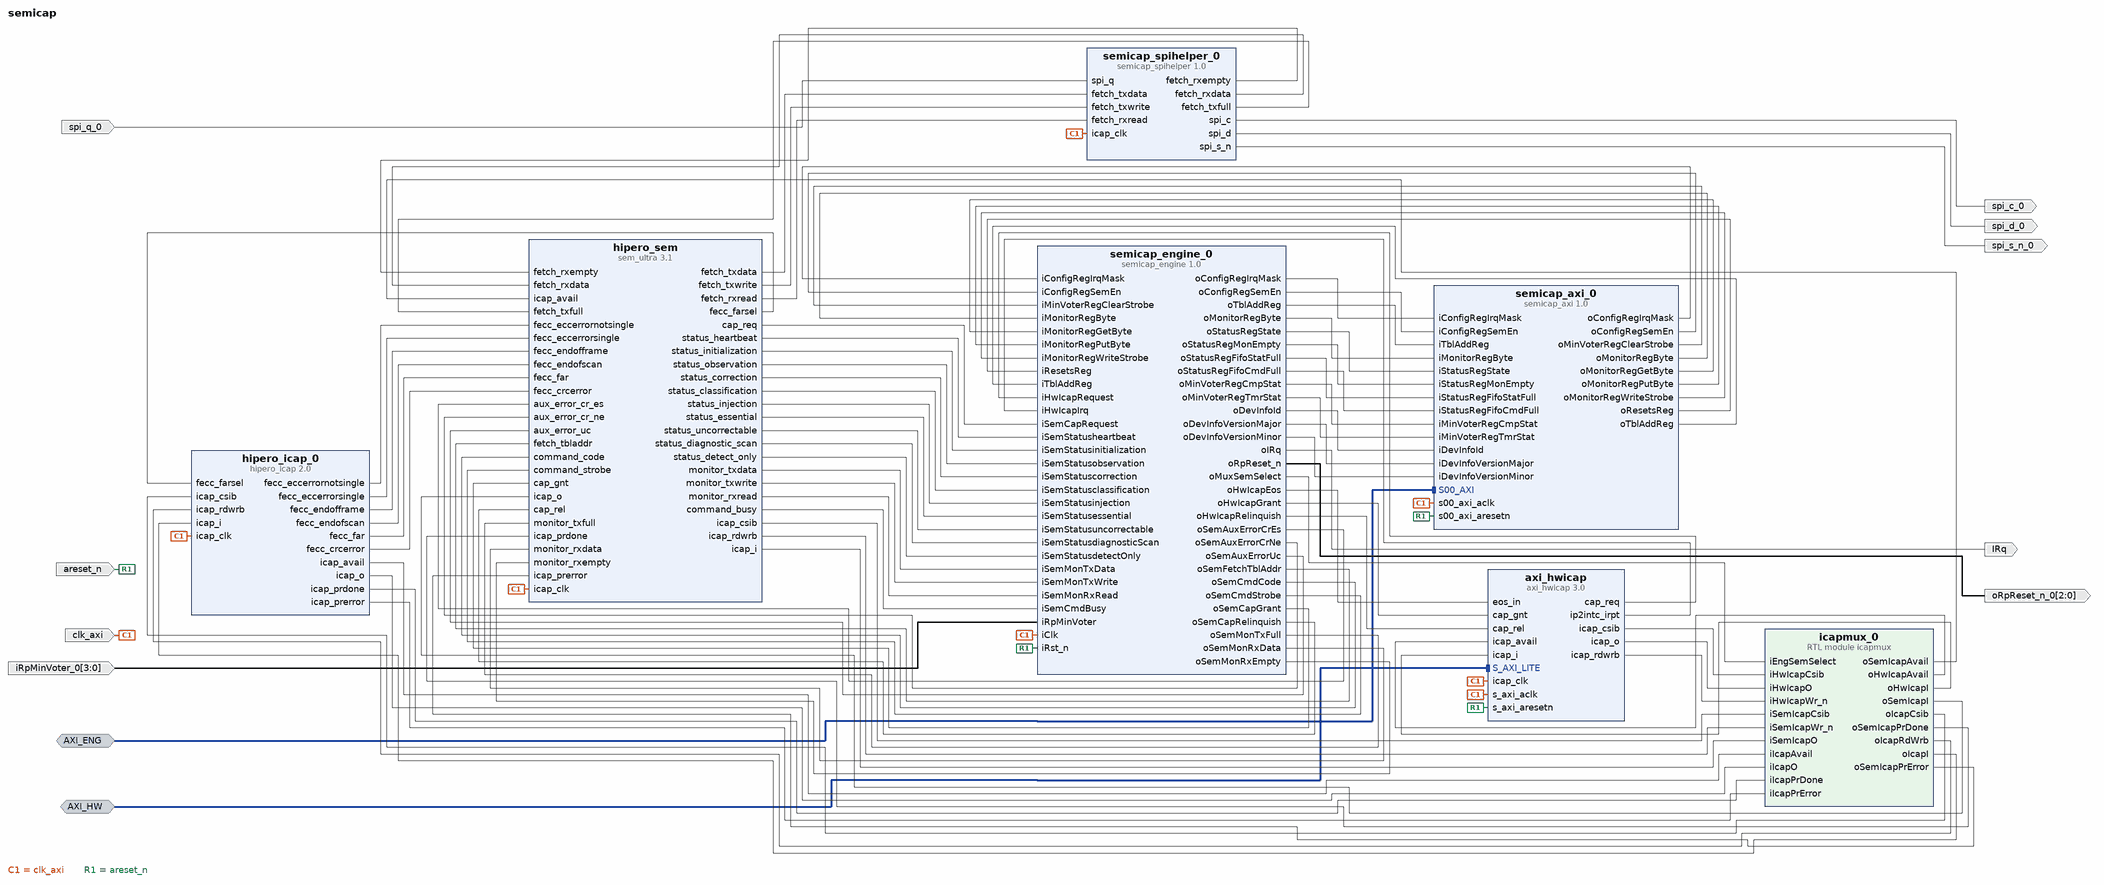
[diagram p0: block diagram of the top level]
# Vivado block design semicap, xcku040-ffva1156-2-e, Vivado 2019.1.1
create_bd_design semicap

create_bd_intf_port -mode Slave -vlnv xilinx.com:interface:aximm_rtl:1.0 AXI_ENG
set_property -dict [list \
  CONFIG.ADDR_WIDTH 12 \
  CONFIG.ARUSER_WIDTH 0 \
  CONFIG.AWUSER_WIDTH 0 \
  CONFIG.BUSER_WIDTH 0 \
  CONFIG.DATA_WIDTH 32 \
  CONFIG.HAS_BRESP 1 \
  CONFIG.HAS_BURST 0 \
  CONFIG.HAS_CACHE 0 \
  CONFIG.HAS_LOCK 0 \
  CONFIG.HAS_PROT 1 \
  CONFIG.HAS_QOS 0 \
  CONFIG.HAS_REGION 0 \
  CONFIG.HAS_RRESP 1 \
  CONFIG.HAS_WSTRB 1 \
  CONFIG.ID_WIDTH 0 \
  CONFIG.MAX_BURST_LENGTH 1 \
  CONFIG.NUM_READ_OUTSTANDING 1 \
  CONFIG.NUM_READ_THREADS 1 \
  CONFIG.NUM_WRITE_OUTSTANDING 1 \
  CONFIG.NUM_WRITE_THREADS 1 \
  CONFIG.PROTOCOL AXI4LITE \
  CONFIG.READ_WRITE_MODE READ_WRITE \
  CONFIG.RUSER_BITS_PER_BYTE 0 \
  CONFIG.RUSER_WIDTH 0 \
  CONFIG.SUPPORTS_NARROW_BURST 0 \
  CONFIG.WUSER_BITS_PER_BYTE 0 \
  CONFIG.WUSER_WIDTH 0 \
] [get_bd_intf_ports AXI_ENG]
create_bd_intf_port -mode Slave -vlnv xilinx.com:interface:aximm_rtl:1.0 AXI_HW
set_property -dict [list \
  CONFIG.ADDR_WIDTH 12 \
  CONFIG.ARUSER_WIDTH 0 \
  CONFIG.AWUSER_WIDTH 0 \
  CONFIG.BUSER_WIDTH 0 \
  CONFIG.DATA_WIDTH 32 \
  CONFIG.HAS_BRESP 1 \
  CONFIG.HAS_BURST 0 \
  CONFIG.HAS_CACHE 0 \
  CONFIG.HAS_LOCK 0 \
  CONFIG.HAS_PROT 0 \
  CONFIG.HAS_QOS 0 \
  CONFIG.HAS_REGION 0 \
  CONFIG.HAS_RRESP 1 \
  CONFIG.HAS_WSTRB 1 \
  CONFIG.ID_WIDTH 0 \
  CONFIG.MAX_BURST_LENGTH 1 \
  CONFIG.NUM_READ_OUTSTANDING 1 \
  CONFIG.NUM_READ_THREADS 1 \
  CONFIG.NUM_WRITE_OUTSTANDING 1 \
  CONFIG.NUM_WRITE_THREADS 1 \
  CONFIG.PROTOCOL AXI4LITE \
  CONFIG.READ_WRITE_MODE READ_WRITE \
  CONFIG.RUSER_BITS_PER_BYTE 0 \
  CONFIG.RUSER_WIDTH 0 \
  CONFIG.SUPPORTS_NARROW_BURST 0 \
  CONFIG.WUSER_BITS_PER_BYTE 0 \
  CONFIG.WUSER_WIDTH 0 \
] [get_bd_intf_ports AXI_HW]
create_bd_port -dir I spi_q_0
create_bd_port -dir O spi_c_0
create_bd_port -dir O spi_d_0
create_bd_port -dir O spi_s_n_0
create_bd_port -dir O IRq
create_bd_port -dir O -from 2 -to 0 oRpReset_n_0
create_bd_port -dir I -from 3 -to 0 iRpMinVoter_0
create_bd_port -dir I -type clk clk_axi
set_property -dict [list \
  CONFIG.ASSOCIATED_BUSIF AXI_ENG:AXI_HW \
  CONFIG.ASSOCIATED_RESET areset_n \
  CONFIG.FREQ_HZ 100000000 \
] [get_bd_ports clk_axi]
create_bd_port -dir I -type rst areset_n

create_bd_cell -type ip -vlnv cbkpan:hipero:hipero_icap:2.0 hipero_icap_0
create_bd_cell -type ip -vlnv xilinx.com:ip:axi_hwicap:3.0 axi_hwicap
set_property -dict [list \
  CONFIG.C_ICAP_EXTERNAL 1 \
  CONFIG.C_MODE 0 \
  CONFIG.C_OPERATION 1 \
  CONFIG.C_READ_FIFO_DEPTH 256 \
  CONFIG.C_WRITE_FIFO_DEPTH 1024 \
] [get_bd_cells axi_hwicap]
create_bd_cell -type ip -vlnv xilinx.com:ip:sem_ultra:3.1 hipero_sem
set_property -dict [list \
  CONFIG.ENABLE_CLASSIFICATION true \
  CONFIG.LOCATE_CONFIG_PRIM example_design \
  CONFIG.MODE mitigation_and_testing \
] [get_bd_cells hipero_sem]
create_bd_cell -type ip -vlnv cbkpan:hipero:semicap_axi:1.0 semicap_axi_0
create_bd_cell -type module -reference icapmux icapmux_0
create_bd_cell -type ip -vlnv cbkpan:hipero:semicap_engine:1.0 semicap_engine_0
create_bd_cell -type ip -vlnv cbkpan:hipero:semicap_spihelper:1.0 semicap_spihelper_0

# ---- connections ----

connect_bd_intf_net -intf_net S00_AXI_0_1 [get_bd_intf_ports AXI_ENG] [get_bd_intf_pins semicap_axi_0/S00_AXI]
connect_bd_intf_net -intf_net S_AXI_LITE_0_1 [get_bd_intf_ports AXI_HW] [get_bd_intf_pins axi_hwicap/S_AXI_LITE]
connect_bd_net [get_bd_pins hipero_sem/fecc_farsel] [get_bd_pins hipero_icap_0/fecc_farsel]
connect_bd_net [get_bd_pins hipero_icap_0/fecc_eccerrornotsingle] [get_bd_pins hipero_sem/fecc_eccerrornotsingle]
connect_bd_net [get_bd_pins hipero_icap_0/fecc_eccerrorsingle] [get_bd_pins hipero_sem/fecc_eccerrorsingle]
connect_bd_net [get_bd_pins hipero_icap_0/fecc_endofframe] [get_bd_pins hipero_sem/fecc_endofframe]
connect_bd_net [get_bd_pins hipero_icap_0/fecc_endofscan] [get_bd_pins hipero_sem/fecc_endofscan]
connect_bd_net [get_bd_pins hipero_icap_0/fecc_far] [get_bd_pins hipero_sem/fecc_far]
connect_bd_net [get_bd_pins hipero_icap_0/fecc_crcerror] [get_bd_pins hipero_sem/fecc_crcerror]
connect_bd_net -net spi_q_0_1 [get_bd_ports spi_q_0] [get_bd_pins semicap_spihelper_0/spi_q]
connect_bd_net [get_bd_pins hipero_sem/fetch_txdata] [get_bd_pins semicap_spihelper_0/fetch_txdata]
connect_bd_net [get_bd_pins hipero_sem/fetch_txwrite] [get_bd_pins semicap_spihelper_0/fetch_txwrite]
connect_bd_net [get_bd_pins hipero_sem/fetch_rxread] [get_bd_pins semicap_spihelper_0/fetch_rxread]
connect_bd_net [get_bd_pins semicap_spihelper_0/fetch_rxempty] [get_bd_pins hipero_sem/fetch_rxempty]
connect_bd_net [get_bd_pins semicap_spihelper_0/spi_c] [get_bd_ports spi_c_0]
connect_bd_net [get_bd_pins semicap_spihelper_0/spi_d] [get_bd_ports spi_d_0]
connect_bd_net [get_bd_pins semicap_spihelper_0/spi_s_n] [get_bd_ports spi_s_n_0]
connect_bd_net [get_bd_pins semicap_axi_0/oConfigRegIrqMask] [get_bd_pins semicap_engine_0/iConfigRegIrqMask]
connect_bd_net [get_bd_pins semicap_axi_0/oConfigRegSemEn] [get_bd_pins semicap_engine_0/iConfigRegSemEn]
connect_bd_net [get_bd_pins semicap_axi_0/oMinVoterRegClearStrobe] [get_bd_pins semicap_engine_0/iMinVoterRegClearStrobe]
connect_bd_net [get_bd_pins semicap_axi_0/oMonitorRegByte] [get_bd_pins semicap_engine_0/iMonitorRegByte]
connect_bd_net [get_bd_pins semicap_axi_0/oMonitorRegGetByte] [get_bd_pins semicap_engine_0/iMonitorRegGetByte]
connect_bd_net [get_bd_pins semicap_axi_0/oMonitorRegPutByte] [get_bd_pins semicap_engine_0/iMonitorRegPutByte]
connect_bd_net [get_bd_pins semicap_axi_0/oMonitorRegWriteStrobe] [get_bd_pins semicap_engine_0/iMonitorRegWriteStrobe]
connect_bd_net [get_bd_pins semicap_axi_0/oResetsReg] [get_bd_pins semicap_engine_0/iResetsReg]
connect_bd_net [get_bd_pins semicap_axi_0/oTblAddReg] [get_bd_pins semicap_engine_0/iTblAddReg]
connect_bd_net [get_bd_pins semicap_engine_0/oConfigRegIrqMask] [get_bd_pins semicap_axi_0/iConfigRegIrqMask]
connect_bd_net [get_bd_pins semicap_engine_0/oConfigRegSemEn] [get_bd_pins semicap_axi_0/iConfigRegSemEn]
connect_bd_net [get_bd_pins semicap_engine_0/oTblAddReg] [get_bd_pins semicap_axi_0/iTblAddReg]
connect_bd_net [get_bd_pins semicap_engine_0/oMonitorRegByte] [get_bd_pins semicap_axi_0/iMonitorRegByte]
connect_bd_net [get_bd_pins semicap_engine_0/oStatusRegState] [get_bd_pins semicap_axi_0/iStatusRegState]
connect_bd_net [get_bd_pins semicap_engine_0/oStatusRegMonEmpty] [get_bd_pins semicap_axi_0/iStatusRegMonEmpty]
connect_bd_net [get_bd_pins semicap_engine_0/oStatusRegFifoStatFull] [get_bd_pins semicap_axi_0/iStatusRegFifoStatFull]
connect_bd_net [get_bd_pins semicap_engine_0/oStatusRegFifoCmdFull] [get_bd_pins semicap_axi_0/iStatusRegFifoCmdFull]
connect_bd_net [get_bd_pins semicap_engine_0/oMinVoterRegCmpStat] [get_bd_pins semicap_axi_0/iMinVoterRegCmpStat]
connect_bd_net [get_bd_pins semicap_engine_0/oMinVoterRegTmrStat] [get_bd_pins semicap_axi_0/iMinVoterRegTmrStat]
connect_bd_net [get_bd_pins semicap_engine_0/oDevInfoId] [get_bd_pins semicap_axi_0/iDevInfoId]
connect_bd_net [get_bd_pins semicap_engine_0/oDevInfoVersionMajor] [get_bd_pins semicap_axi_0/iDevInfoVersionMajor]
connect_bd_net [get_bd_pins semicap_engine_0/oDevInfoVersionMinor] [get_bd_pins semicap_axi_0/iDevInfoVersionMinor]
connect_bd_net [get_bd_pins semicap_engine_0/oIRq] [get_bd_ports IRq]
connect_bd_net [get_bd_pins hipero_icap_0/icap_avail] [get_bd_pins icapmux_0/iIcapAvail]
connect_bd_net [get_bd_pins hipero_icap_0/icap_o] [get_bd_pins icapmux_0/iIcapO]
connect_bd_net [get_bd_pins hipero_icap_0/icap_prdone] [get_bd_pins icapmux_0/iIcapPrDone]
connect_bd_net [get_bd_pins hipero_icap_0/icap_prerror] [get_bd_pins icapmux_0/iIcapPrError]
connect_bd_net [get_bd_pins icapmux_0/oIcapCsib] [get_bd_pins hipero_icap_0/icap_csib]
connect_bd_net [get_bd_pins icapmux_0/oIcapRdWrb] [get_bd_pins hipero_icap_0/icap_rdwrb]
connect_bd_net [get_bd_pins icapmux_0/oIcapI] [get_bd_pins hipero_icap_0/icap_i]
connect_bd_net [get_bd_pins icapmux_0/oHwIcapAvail] [get_bd_pins axi_hwicap/icap_avail]
connect_bd_net [get_bd_pins axi_hwicap/icap_csib] [get_bd_pins icapmux_0/iHwIcapCsib]
connect_bd_net [get_bd_pins axi_hwicap/icap_o] [get_bd_pins icapmux_0/iHwIcapO]
connect_bd_net [get_bd_pins icapmux_0/oHwIcapI] [get_bd_pins axi_hwicap/icap_i]
connect_bd_net [get_bd_pins axi_hwicap/icap_rdwrb] [get_bd_pins icapmux_0/iHwIcapWr_n]
connect_bd_net [get_bd_pins semicap_engine_0/oHwIcapEos] [get_bd_pins axi_hwicap/eos_in]
connect_bd_net [get_bd_pins semicap_engine_0/oHwIcapGrant] [get_bd_pins axi_hwicap/cap_gnt]
connect_bd_net [get_bd_pins semicap_engine_0/oHwIcapRelinquish] [get_bd_pins axi_hwicap/cap_rel]
connect_bd_net [get_bd_pins axi_hwicap/cap_req] [get_bd_pins semicap_engine_0/iHwIcapRequest]
connect_bd_net [get_bd_pins axi_hwicap/ip2intc_irpt] [get_bd_pins semicap_engine_0/iHwIcapIrq]
connect_bd_net [get_bd_pins hipero_sem/icap_csib] [get_bd_pins icapmux_0/iSemIcapCsib]
connect_bd_net [get_bd_pins hipero_sem/icap_rdwrb] [get_bd_pins icapmux_0/iSemIcapWr_n]
connect_bd_net [get_bd_pins icapmux_0/oSemIcapAvail] [get_bd_pins hipero_sem/icap_avail]
connect_bd_net [get_bd_pins icapmux_0/oSemIcapI] [get_bd_pins hipero_sem/icap_o]
connect_bd_net [get_bd_pins icapmux_0/oSemIcapPrDone] [get_bd_pins hipero_sem/icap_prdone]
connect_bd_net [get_bd_pins icapmux_0/oSemIcapPrError] [get_bd_pins hipero_sem/icap_prerror]
connect_bd_net [get_bd_pins hipero_sem/icap_i] [get_bd_pins icapmux_0/iSemIcapO]
connect_bd_net [get_bd_pins semicap_engine_0/oMuxSemSelect] [get_bd_pins icapmux_0/iEngSemSelect]
connect_bd_net [get_bd_pins semicap_engine_0/oSemAuxErrorCrEs] [get_bd_pins hipero_sem/aux_error_cr_es]
connect_bd_net [get_bd_pins semicap_engine_0/oSemAuxErrorCrNe] [get_bd_pins hipero_sem/aux_error_cr_ne]
connect_bd_net [get_bd_pins semicap_engine_0/oSemAuxErrorUc] [get_bd_pins hipero_sem/aux_error_uc]
connect_bd_net [get_bd_pins semicap_engine_0/oRpReset_n] [get_bd_ports oRpReset_n_0]
connect_bd_net [get_bd_pins semicap_engine_0/oSemFetchTblAddr] [get_bd_pins hipero_sem/fetch_tbladdr]
connect_bd_net [get_bd_pins semicap_engine_0/oSemCmdCode] [get_bd_pins hipero_sem/command_code]
connect_bd_net [get_bd_pins semicap_engine_0/oSemCmdStrobe] [get_bd_pins hipero_sem/command_strobe]
connect_bd_net [get_bd_pins semicap_engine_0/oSemCapGrant] [get_bd_pins hipero_sem/cap_gnt]
connect_bd_net [get_bd_pins semicap_engine_0/oSemCapRelinquish] [get_bd_pins hipero_sem/cap_rel]
connect_bd_net [get_bd_pins hipero_sem/cap_req] [get_bd_pins semicap_engine_0/iSemCapRequest]
connect_bd_net [get_bd_pins hipero_sem/status_heartbeat] [get_bd_pins semicap_engine_0/iSemStatusheartbeat]
connect_bd_net [get_bd_pins hipero_sem/status_initialization] [get_bd_pins semicap_engine_0/iSemStatusinitialization]
connect_bd_net [get_bd_pins hipero_sem/status_observation] [get_bd_pins semicap_engine_0/iSemStatusobservation]
connect_bd_net [get_bd_pins hipero_sem/status_correction] [get_bd_pins semicap_engine_0/iSemStatuscorrection]
connect_bd_net [get_bd_pins hipero_sem/status_classification] [get_bd_pins semicap_engine_0/iSemStatusclassification]
connect_bd_net [get_bd_pins hipero_sem/status_injection] [get_bd_pins semicap_engine_0/iSemStatusinjection]
connect_bd_net [get_bd_pins hipero_sem/status_essential] [get_bd_pins semicap_engine_0/iSemStatusessential]
connect_bd_net [get_bd_pins hipero_sem/status_uncorrectable] [get_bd_pins semicap_engine_0/iSemStatusuncorrectable]
connect_bd_net [get_bd_pins hipero_sem/status_diagnostic_scan] [get_bd_pins semicap_engine_0/iSemStatusdiagnosticScan]
connect_bd_net [get_bd_pins hipero_sem/status_detect_only] [get_bd_pins semicap_engine_0/iSemStatusdetectOnly]
connect_bd_net [get_bd_pins semicap_engine_0/oSemMonTxFull] [get_bd_pins hipero_sem/monitor_txfull]
connect_bd_net [get_bd_pins semicap_engine_0/oSemMonRxData] [get_bd_pins hipero_sem/monitor_rxdata]
connect_bd_net [get_bd_pins semicap_engine_0/oSemMonRxEmpty] [get_bd_pins hipero_sem/monitor_rxempty]
connect_bd_net [get_bd_pins hipero_sem/monitor_txdata] [get_bd_pins semicap_engine_0/iSemMonTxData]
connect_bd_net [get_bd_pins hipero_sem/monitor_txwrite] [get_bd_pins semicap_engine_0/iSemMonTxWrite]
connect_bd_net [get_bd_pins hipero_sem/monitor_rxread] [get_bd_pins semicap_engine_0/iSemMonRxRead]
connect_bd_net [get_bd_pins hipero_sem/command_busy] [get_bd_pins semicap_engine_0/iSemCmdBusy]
connect_bd_net -net iRpMinVoter_0_1 [get_bd_ports iRpMinVoter_0] [get_bd_pins semicap_engine_0/iRpMinVoter]
connect_bd_net [get_bd_pins semicap_spihelper_0/fetch_rxdata] [get_bd_pins hipero_sem/fetch_rxdata]
connect_bd_net [get_bd_pins semicap_spihelper_0/fetch_txfull] [get_bd_pins hipero_sem/fetch_txfull]
connect_bd_net -net clk_100MHz_1 [get_bd_ports clk_axi] \
  [get_bd_pins hipero_icap_0/icap_clk] [get_bd_pins axi_hwicap/icap_clk] [get_bd_pins axi_hwicap/s_axi_aclk] \
  [get_bd_pins hipero_sem/icap_clk] [get_bd_pins semicap_axi_0/s00_axi_aclk] [get_bd_pins semicap_engine_0/iClk] \
  [get_bd_pins semicap_spihelper_0/icap_clk]
connect_bd_net -net s00_axi_aresetn_0_1 [get_bd_ports areset_n] \
  [get_bd_pins axi_hwicap/s_axi_aresetn] [get_bd_pins semicap_axi_0/s00_axi_aresetn] [get_bd_pins semicap_engine_0/iRst_n]

# ---- address map ----
assign_bd_address -offset 0x000 -range 4K -target_address_space [get_bd_addr_spaces AXI_ENG] [get_bd_addr_segs semicap_axi_0/S00_AXI/S00_AXI_reg]
assign_bd_address -offset 0x000 -range 4K -target_address_space [get_bd_addr_spaces AXI_HW] [get_bd_addr_segs axi_hwicap/S_AXI_LITE/Reg]

validate_bd_design
save_bd_design
